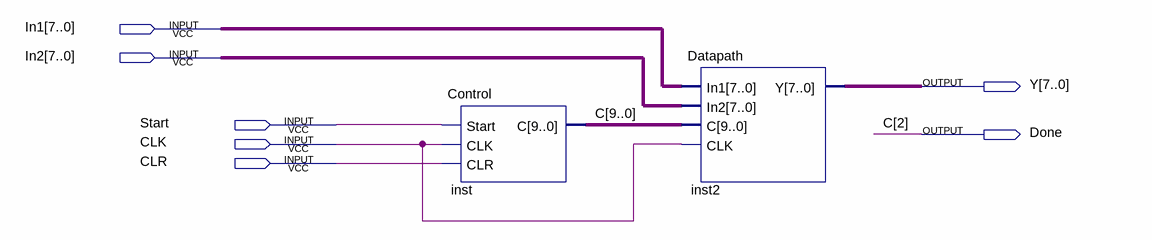
[diagram p0: schematic sheet]
// Quartus schematic Register_mer.bdf as structural Verilog: 2 symbols, 7 pins
module Register_mer (
  input  [7:0] In1,
  input  [7:0] In2,
  input  Start,
  input  CLK,
  input  CLR,
  output [7:0] Y,
  output Done
);

  wire [9:0] C;

  Control inst (.Start(Start), .CLK(CLK), .CLR(CLR), .C({C[9:3], Done, C[1:0]}));
  Datapath inst2 (.In1(In1), .In2(In2), .C({C[9:3], Done, C[1:0]}), .CLK(CLK), .Y(Y));

  // Other names for the same wires on the sheet: C[2] = Done
endmodule
